# EAGLE schematic BareBoard (EAGLE 9.6.2)
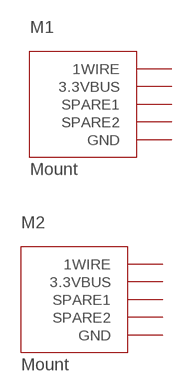
[diagram p0: schematic, sheet 1]

## Parts
M1  Mount  4X8MOUNT  [4X8MOUNT]
M2  Mount  4X8MOUNT  [4X8MOUNT]
Unconnected: M1.P$1(GND) M1.P$2(1WIRE) M1.P$3(SPARE2) M1.P$4(3.3VBUS) M1.P$5(1WIRE) M1.P$6(SPARE1) M1.P$7(3.3VBUS) M1.P$8(GND) M2.P$1(GND) M2.P$2(1WIRE) M2.P$3(SPARE2) M2.P$4(3.3VBUS) M2.P$5(1WIRE) M2.P$6(SPARE1) M2.P$7(3.3VBUS) M2.P$8(GND)

## Library data of the parts
M1 M2 = uStar:4X8MOUNT: 4x8 MOUNT for EDGEQUBE; NO_PN: Hole pattern template